# Altium schematic sheet Power.SchDoc
size A4; SheetNumber: 1; SheetTotal: 3; PageSetup: Record=PageOptions|CenterHorizontal=True|CenterVertical=True|PrintScale=1.00|XCorrection=1.00|YCorrection=1.00|PrintKind=0|BorderSize=5000000|LeftOffset=0|BottomOffset=0|Orientation=2|PaperLength=1000|PaperWidth=1000|Scale=100|PaperSource=7|PrintQuality=-3|MediaType=1|DitherType=10|PrintScaleMode=1|PaperKind=A4|PaperIndex=9
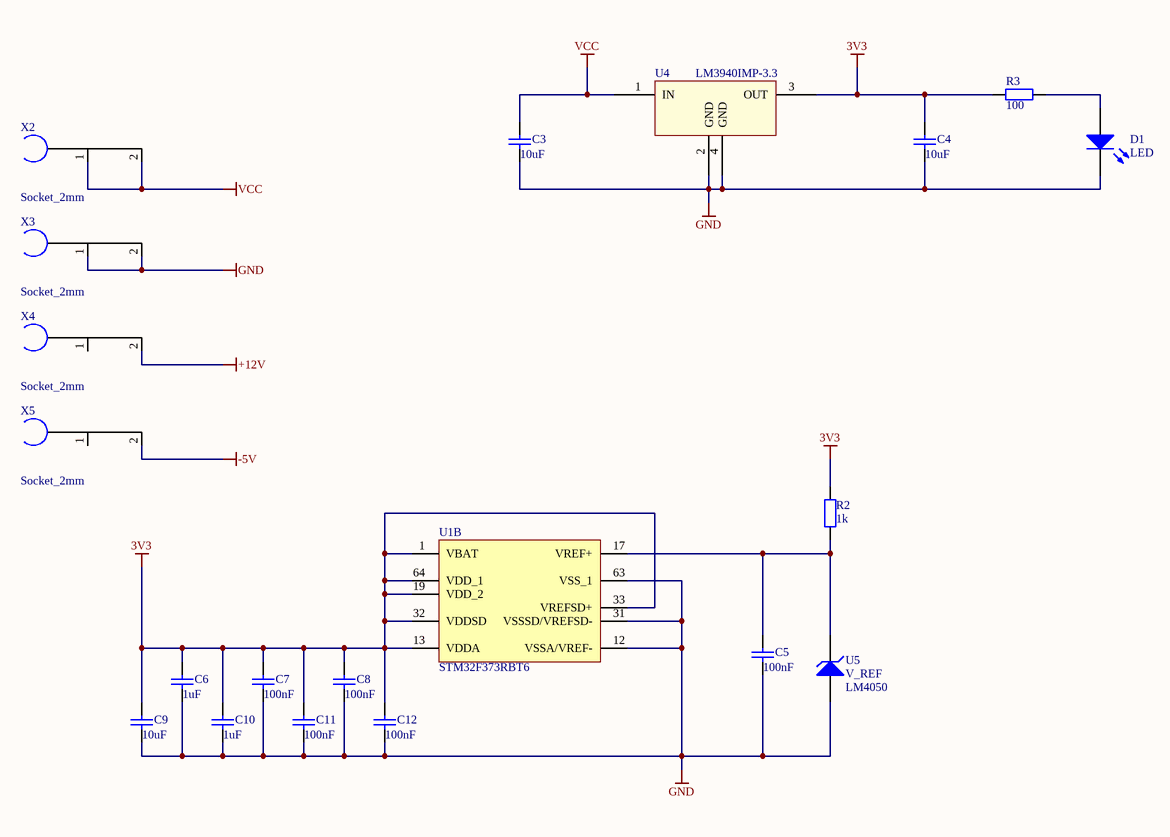
[diagram p0: Power.SchDoc]

## Parts
C3  value 10uF  [0805]  (hidden comment: C)
C4  value 10uF  [0805]  (hidden comment: C)
C5  value 100nF  [0805]  (hidden comment: C)
C6  value 1uF  [0805]  (hidden comment: C)
C7  value 100nF  [0805]  (hidden comment: C)
C8  value 100nF  [0805]  (hidden comment: C)
C9  value 10uF  [0805]  (hidden comment: C)
C10  value 1uF  [0805]  (hidden comment: C)
C11  value 100nF  [0805]  (hidden comment: C)
C12  value 100nF  [0805]  (hidden comment: C)
D1  LED  [D_0603]
R2  value 1k  [R_0603]  (hidden comment: R)
R3  value 100  [R_0603]  (hidden comment: R)
U1  STM32F373RBT6  [STM-LQFP64_V]  (part B of 2)
U4  LM3940IMP-3.3  [SOT-223]
U5  V_REF  value LM4050  [SOT-23]
X2  Socket_2mm  [2MM_BANANA]
X3  Socket_2mm  [2MM_BANANA]
X4  Socket_2mm  [2MM_BANANA]
X5  Socket_2mm  [2MM_BANANA]

## Nets
3V3: C4.2 C6.2 C7.2 C8.1 C9.2 C10.2 C11.2 C12.2 R2.2 R3.1 U1.1(VBAT) U1.13(VDDA) U1.19(VDD_2) U1.32(VDDSD) U1.33(VREFSD+) U1.64(VDD_1) U4.3(OUT)
+12V: X4.2
-5V: X5.2
GND: C3.1 C4.1 C5.1 C6.1 C7.1 C8.2 C9.1 C10.1 C11.1 C12.1 D1.2(K) U1.12(VSSA/VREF-) U1.31(VSSSD/VREFSD-) U1.63(VSS_1) U4.2(GND) U4.4(GND) U5.2(A) X3.1 X3.2
VCC: C3.2 U4.1(IN) X2.1 X2.2
NetC5_2: C5.2 R2.1 U1.17(VREF+) U5.1(K)
NetD1_1: D1.1(A) R3.2

Not connected (* = marked no-connect by the designer): X4 1; X5 1

## Library data of the parts
D1 = LED: Value: BLU
R2 R3 = RES_EU
U1 = CMP-0572-00032-2: ARM Cortex-M4 32-bit MCU, 128 KB Flash, 24 KB Internal RAM, 52 I/Os, 64-pin LQFP, -40 to 85 degC, Tray; FLASH Size (Prog) (kB): 128; Operating Frequency(F) (Processor speed) (MHz): 72; Supply Voltage(Vcc) min (V): 2; Internal RAM Size (kB): 24; I/Os (High Current): 52; PackageVersion: Rev. 4, 06/2013; Core: ARM Cortex-M4; Packing: Tray; ComponentLink2URL: http://www.st.com/st-web-ui/static/active/en/resource/technical/document/datasheet/DM00046749.pdf; PackageReference: LQFP64; PartNumber: STM32F373RBT6; ComponentLink1URL: http://www.st.com/web/en/home.html; ComponentLink1Description: Manufacturer URL; PackageDescription: 64-Pin Low Profile Quad Flat Package, 10 x 10 mm Body, 0.5 mm Pitch; DatasheetVersion: Rev. 3; ComponentLink3Description: Package Specification; ComponentLink2Description: Datasheet; Mounting Technology: Surface Mount; ComponentLink3URL: http://www.st.com/st-web-ui/static/active/en/resource/technical/document/datasheet/DM00037051.pdf
X2 X4 = Socket_2mm: Value: Banana_2mm_RED
X3 X5 = Socket_2mm: Value: Banana_2mm_BLK
U4 = LM3940IMP-3.3: Value: LM3940IMP-3.3